# EAGLE schematic mixJTGA32 (EAGLE 7.2.0)
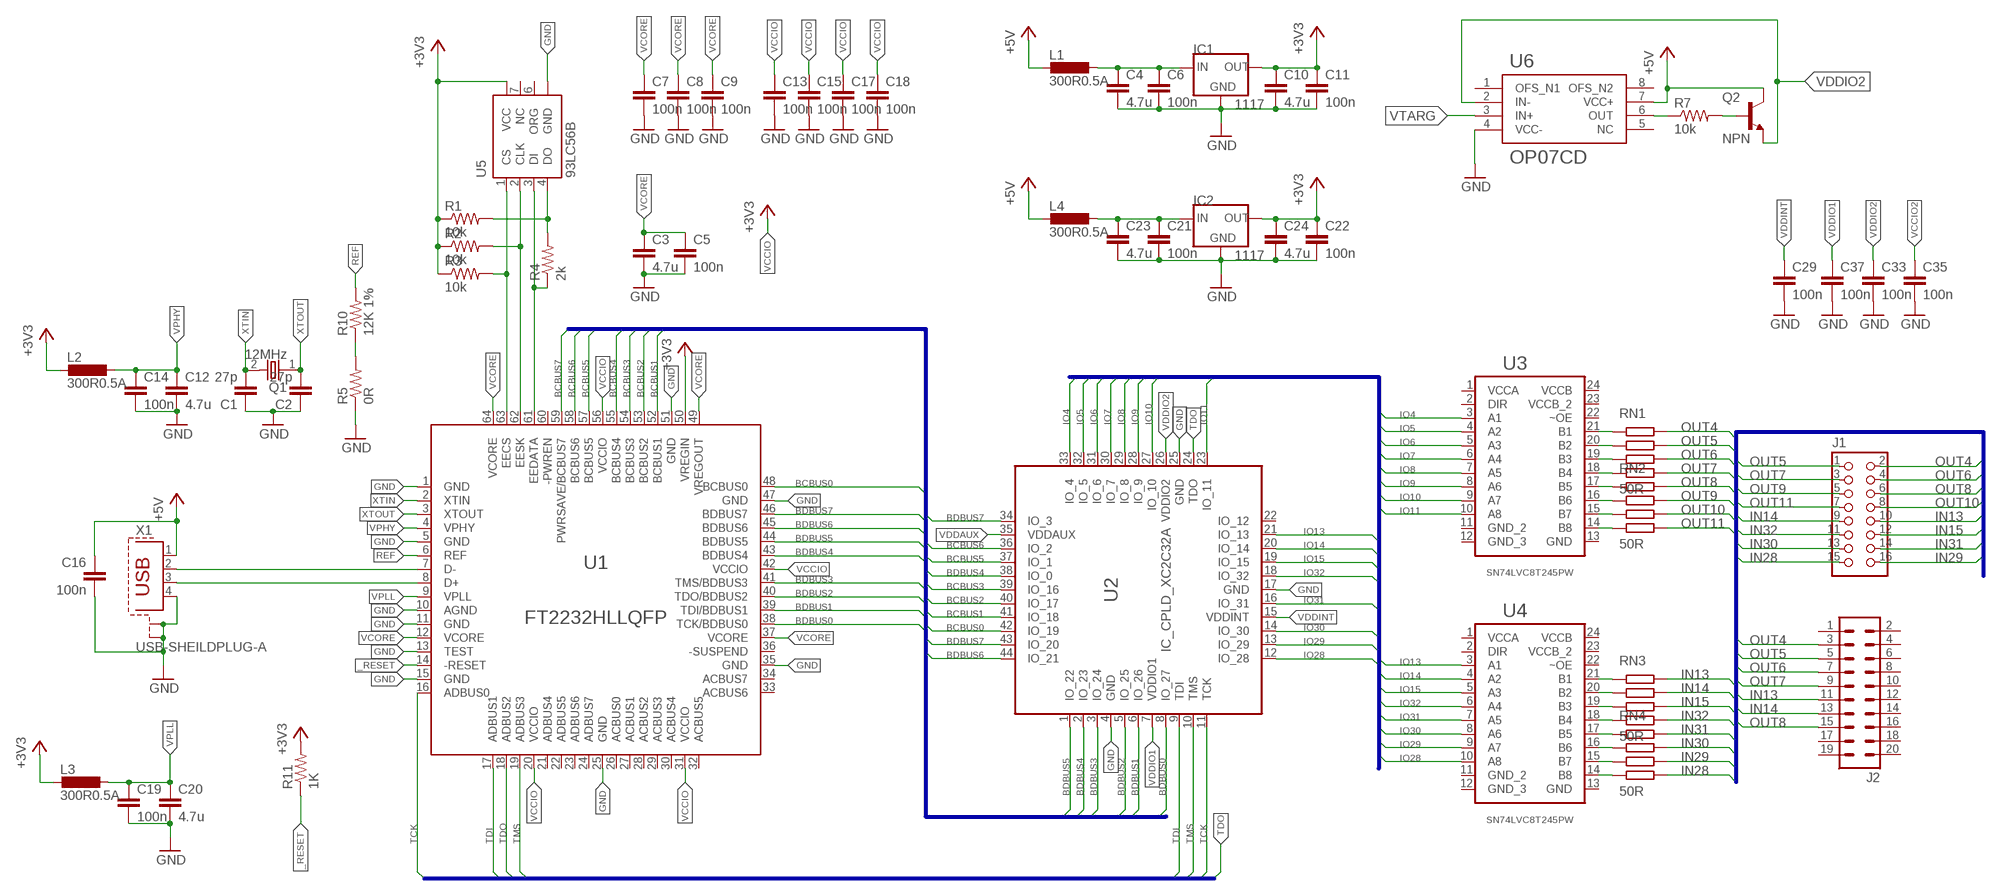
[diagram p0: schematic, sheet 1]

## Parts
C1  27p  C-EU025-025X050  [C025-025X050]
C2  27p  C-EU025-025X050  [C025-025X050]
C3  4.7u  C-EUC0805K  [C0805K]
C4  4.7u  C-EUC0805K  [C0805K]
C5  100n  C-EUC0805  [C0805]
C6  100n  C-EUC0805  [C0805]
C7  100n  C-EUC0805  [C0805]
C8  100n  C-EUC0805  [C0805]
C9  100n  C-EUC0805  [C0805]
C10  4.7u  C-EUC0805K  [C0805K]
C11  100n  C-EUC0805  [C0805]
C12  4.7u  C-EUC0805K  [C0805K]
C13  100n  C-EUC0805  [C0805]
C14  100n  C-EUC0805  [C0805]
C15  100n  C-EUC0805  [C0805]
C16  100n  C-EUC0805  [C0805]
C17  100n  C-EUC0805  [C0805]
C18  100n  C-EUC0805  [C0805]
C19  100n  C-EUC0805  [C0805]
C20  4.7u  C-EUC0805K  [C0805K]
C21  100n  C-EUC0805  [C0805]
C22  100n  C-EUC0805  [C0805]
C23  4.7u  C-EUC0805K  [C0805K]
C24  4.7u  C-EUC0805K  [C0805K]
C29  100n  C-EUC0805  [C0805]
C33  100n  C-EUC0805  [C0805]
C35  100n  C-EUC0805  [C0805]
C37  100n  C-EUC0805  [C0805]
IC1  1117  AMS1117  [SOT223]
IC2  1117  AMS1117  [SOT223]
J1  CON_HEADER_2X08  [M2X8]
J2  ML20  [ML20]
L1  300R0.5A  DO3316P  [R0805]
L2  300R0.5A  DO3316P  [R0805]
L3  300R0.5A  DO3316P  [R0805]
L4  300R0.5A  DO3316P  [R0805]
Q1  12MHz  XT  [HC49/S]
Q2  NPN  BCX70SMD  [SOT23]
R1  10k  R-US_R0805  [R0805]
R2  10k  R-US_R0805  [R0805]
R3  10k  R-US_R0805  [R0805]
R4  2k  R-US_R0805  [R0805]
R5  0R  R-US_R0805  [R0805]
R7  10k  R-US_R0805  [R0805]
R10  12K 1%  R-US_R0805  [R0805]
R11  1K  R-US_R0805  [R0805]
RN1  50R  4R-N  [EXBV8V]
RN2  50R  4R-N  [EXBV8V]
RN3  50R  4R-N  [EXBV8V]
RN4  50R  4R-N  [EXBV8V]
U1  FT2232HLLQFP  [LQFP-64]
U2  IC_CPLD_XC2C32A  [VQ-44]
U3  SN74LVC8T245PW  [SOP65P640X120-24N]
U4  SN74LVC8T245PW  [SOP65P640X120-24N]
U5  93LC56B  PIN2PIN-SOIC8  [SOIC8]
U6  OP07CD  PIN2PIN-SOIC8  [SO08]
X1  USB-SHEILDPLUG-A  [USB-A-HOLE-PLUG]

## Nets
+3V3: C10.1 C11.1 C22.1 C24.1 IC1.2(OUT) IC2.2(OUT) L2.1 L3.1 R1.1 R2.1 R3.1 R11.2 U1.50(VREGIN) U5.8(VCC)
+5V: C16.1 L1.1 L4.1 Q2.3(C) U6.7(VCC+) X1.1
_RESET: R11.1 U1.14(-RESET)
BCBUS0: U1.48(BCBUS0) U2.42(IO_19)
BCBUS1: U1.52(BCBUS1) U2.41(IO_18)
BCBUS2: U1.53(BCBUS2) U2.40(IO_17)
BCBUS3: U1.54(BCBUS3) U2.39(IO_16)
BCBUS4: U1.55(BCBUS4)
BCBUS5: U1.57(BCBUS5) U2.37(IO_1)
BCBUS6: U1.58(BCBUS6) U2.36(IO_2)
BCBUS7: U1.59(PWRSAVE/BCBUS7)
BDBUS0: U1.38(TCK/BDBUS0) U2.8(IO_27)
BDBUS1: U1.39(TDI/BDBUS1) U2.6(IO_26)
BDBUS2: U1.40(TDO/BDBUS2) U2.5(IO_25)
BDBUS3: U1.41(TMS/BDBUS3) U2.3(IO_24)
BDBUS4: U1.43(BDBUS4) U2.2(IO_23) U2.38(IO_0)
BDBUS5: U1.44(BDBUS5) U2.1(IO_22)
BDBUS6: U1.45(BDBUS6) U2.44(IO_21)
BDBUS7: U1.46(BDBUS7) U2.34(IO_3) U2.43(IO_20)
EECS: R3.2 U1.63(EECS) U5.1(CS)
EEDATA: R4.1 U1.61(EEDATA) U5.3(DI)
EESK: R2.2 U1.62(EESK) U5.2(CLK)
GND: C1.1 C2.1 C3.2 C4.2 C5.2 C6.2 C7.2 C8.2 C9.2 C10.2 C11.2 C12.2 C13.2 C14.2 C15.2 C16.2 C17.2 C18.2 C19.2 C20.2 C21.2 C22.2 C23.2 C24.2 C29.2 C33.2 C35.2 C37.2 IC1.1(GND) IC2.1(GND) R5.1 U1.1(GND) U1.5(GND) U1.10(AGND) U1.11(GND) U1.13(TEST) U1.15(GND) U1.25(GND) U1.35(GND) U1.47(GND) U1.51(GND) U5.5(GND) U6.4(VCC-) X1.4 X1.S1 X1.S2
IN13: J1.10 J2.11 RN3.8
IN14: J1.9 J2.13 RN3.7
IN15: J1.12 RN3.6
IN28: J1.15 RN4.5
IN29: J1.16 RN4.6
IN30: J1.13 RN4.7
IN31: J1.14 RN4.8
IN32: J1.11 RN3.5
IO4: U2.33(IO_4) U3.3(A1)
IO5: U2.32(IO_5) U3.4(A2)
IO6: U2.31(IO_6) U3.5(A3)
IO7: U2.30(IO_7) U3.6(A4)
IO8: U2.29(IO_8) U3.7(A5)
IO9: U2.28(IO_9) U3.8(A6)
IO10: U2.27(IO_10) U3.9(A7)
IO11: U2.23(IO_11) U3.10(A8)
IO13: U2.21(IO_13) U4.3(A1)
IO14: U2.20(IO_14) U4.4(A2)
IO15: U2.19(IO_15) U4.5(A3)
IO28: U2.12(IO_28) U4.10(A8)
IO29: U2.13(IO_29) U4.9(A7)
IO30: U2.14(IO_30) U4.8(A6)
IO31: U2.16(IO_31) U4.7(A5)
IO32: U2.18(IO_32) U4.6(A4)
N$1: U1.7(D-) X1.2
N$2: U1.8(D+) X1.3
N$3: C4.1 C6.1 IC1.3(IN) L1.2
N$4: C21.1 C23.1 IC2.3(IN) L4.2
N$5: R5.2 R10.1
N$7: R7.1 U6.6(OUT)
N$8: Q2.1(B) R7.2
N$12: RN1.1 U3.21(B1)
N$13: R1.2 R4.2 U5.4(DO)
N$14: RN2.1 U3.17(B5)
N$15: RN2.2 U3.16(B6)
N$16: RN2.3 U3.15(B7)
N$17: RN2.4 U3.14(B8)
N$18: RN1.2 U3.20(B2)
N$19: RN1.3 U3.19(B3)
N$20: RN1.4 U3.18(B4)
N$21: RN3.1 U4.21(B1)
N$22: RN3.2 U4.20(B2)
N$23: RN3.3 U4.19(B3)
N$24: RN3.4 U4.18(B4)
N$25: RN4.1 U4.17(B5)
N$26: RN4.2 U4.16(B6)
N$27: RN4.3 U4.15(B7)
N$28: RN4.4 U4.14(B8)
OUT4: J1.2 J2.3 RN1.8
OUT5: J1.1 J2.5 RN1.7
OUT6: J1.4 J2.7 RN1.6
OUT7: J1.3 J2.9 RN1.5
OUT8: J1.6 J2.15 RN2.8
OUT9: J1.5 RN2.7
OUT10: J1.8 RN2.6
OUT11: J1.7 RN2.5
REF: R10.2 U1.6(REF)
TCK: U1.16(ADBUS0) U2.11(TCK)
TDI: U1.17(ADBUS1) U2.9(TDI)
TDO: U1.18(ADBUS2) U2.24(TDO)
TMS: U1.19(ADBUS3) U2.10(TMS)
VCCIO: C13.1 C15.1 C17.1 C18.1 U1.20(VCCIO) U1.31(VCCIO) U1.42(VCCIO) U1.56(VCCIO) ; supply symbol labelled +3V3
VCCIO2: C35.1
VCORE: C3.1 C5.1 C7.1 C8.1 C9.1 U1.12(VCORE) U1.37(VCORE) U1.49(VREGOUT) U1.64(VCORE)
VDDAUX: U2.35(VDDAUX)
VDDINT: C29.1 U2.15(VDDINT)
VDDIO1: C37.1 U2.7(VDDIO1)
VDDIO2: C33.1 Q2.2(E) U2.26(VDDIO2) U6.2(IN-)
VPHY: C12.1 C14.1 L2.2 U1.4(VPHY)
VPLL: C19.1 C20.1 L3.2 U1.9(VPLL)
VTARG: U6.3(IN+)
XTIN: C1.2 Q1.2 U1.2(XTIN)
XTOUT: C2.2 Q1.1 U1.3(XTOUT)
Unconnected: J2.1 J2.2 J2.4 J2.6 J2.8 J2.10 J2.12 J2.14 J2.16 J2.17 J2.18 J2.19 J2.20 U1.21(ADBUS4) U1.22(ADBUS5) U1.23(ADBUS6) U1.24(ADBUS7) U1.26(ACBUS0) U1.27(ACBUS1) U1.28(ACBUS2) U1.29(ACBUS3) U1.30(ACBUS4) U1.32(ACBUS5) U1.33(ACBUS6) U1.34(ACBUS7) U1.36(-SUSPEND) U1.60(-PWREN) U2.22(IO_12) U3.2(DIR) U3.11(GND_2) U3.12(GND_3) U3.13(GND) U3.22(~OE) U4.2(DIR) U4.11(GND_2) U4.12(GND_3) U4.13(GND) U4.22(~OE) U5.6(ORG) U5.7(NC) U6.1(OFS_N1) U6.5(NC) U6.8(OFS_N2)

## Buses
BCBUS[0..7],BDBUS[0..7]
TMS,TDI,TDO,TCK
IO[4..15],IO[28..32]
OUT[4..11],IN[13..15],IN[28..32]

## Power pins joined to a net without a drawn wire
GND: U2.4(GND) U2.17(GND) U2.25(GND)
VCCA: U3.1(VCCA) U4.1(VCCA)
VCCB: U3.24(VCCB) U4.24(VCCB)
VCCB_2: U3.23(VCCB_2) U4.23(VCCB_2)

## Library data of the parts
C1-C24 C29 C33 C35 C37 = rcl:C-EU: CAPACITOR, European symbol
IC1 IC2 = bb_ldo:AMS1117
J1 = bb_pinheader:CON_HEADER_2X08
J2 = bb_ml:ML20: HARTING; OC_FARNELL: unknown; OC_NEWARK: unknown
L1-L4 = others:DO3316P: COILCRAFT
Q1 = bb_crystal:XT
Q2 = bb_transistor:BCX70*: NPN Transistor
R1-R5 R7 R10 R11 = rcl:R-US_: RESISTOR, American symbol
RN1-RN4 = bb_ra:4R-N: Array Chip Resistor Source: RS Component / Phycomp
U1 = bb_ft2232hl:FT2232HL: FT2232H
U2 = bb_xc2c32a:IC_CPLD_XC2C32A: xc2c32a_vq44-ian edit this description Auto generated by make-symbol-device-package-bsdl.ulp Rev. 29 Source: xc2c32a_vq44-ian.bsd
U3 U4 = bb_sn74lvc8t245:SN74LVC8T245PW: 8-BIT DUAL-SUPPLY BUS TRANSCEIVER WITH CONFIGURABLE VOLTAGE TRANSLATION AND 3-STATE OUTPUTS; MPN: SN74LVC8T245PW; OC_FARNELL: 1236407; OC_NEWARK: 58K6537; PACKAGE: TSSOP-24; SUPPLIER: Texas Instruments
U5 = 93LC56B:PIN2PIN-SOIC8
U6 = bb_op07:PIN2PIN-SOIC8
X1 = bb_con-usb:USB-SHEILD: USB connector with sheild